# Altium project MINIMP3.PrjPcb
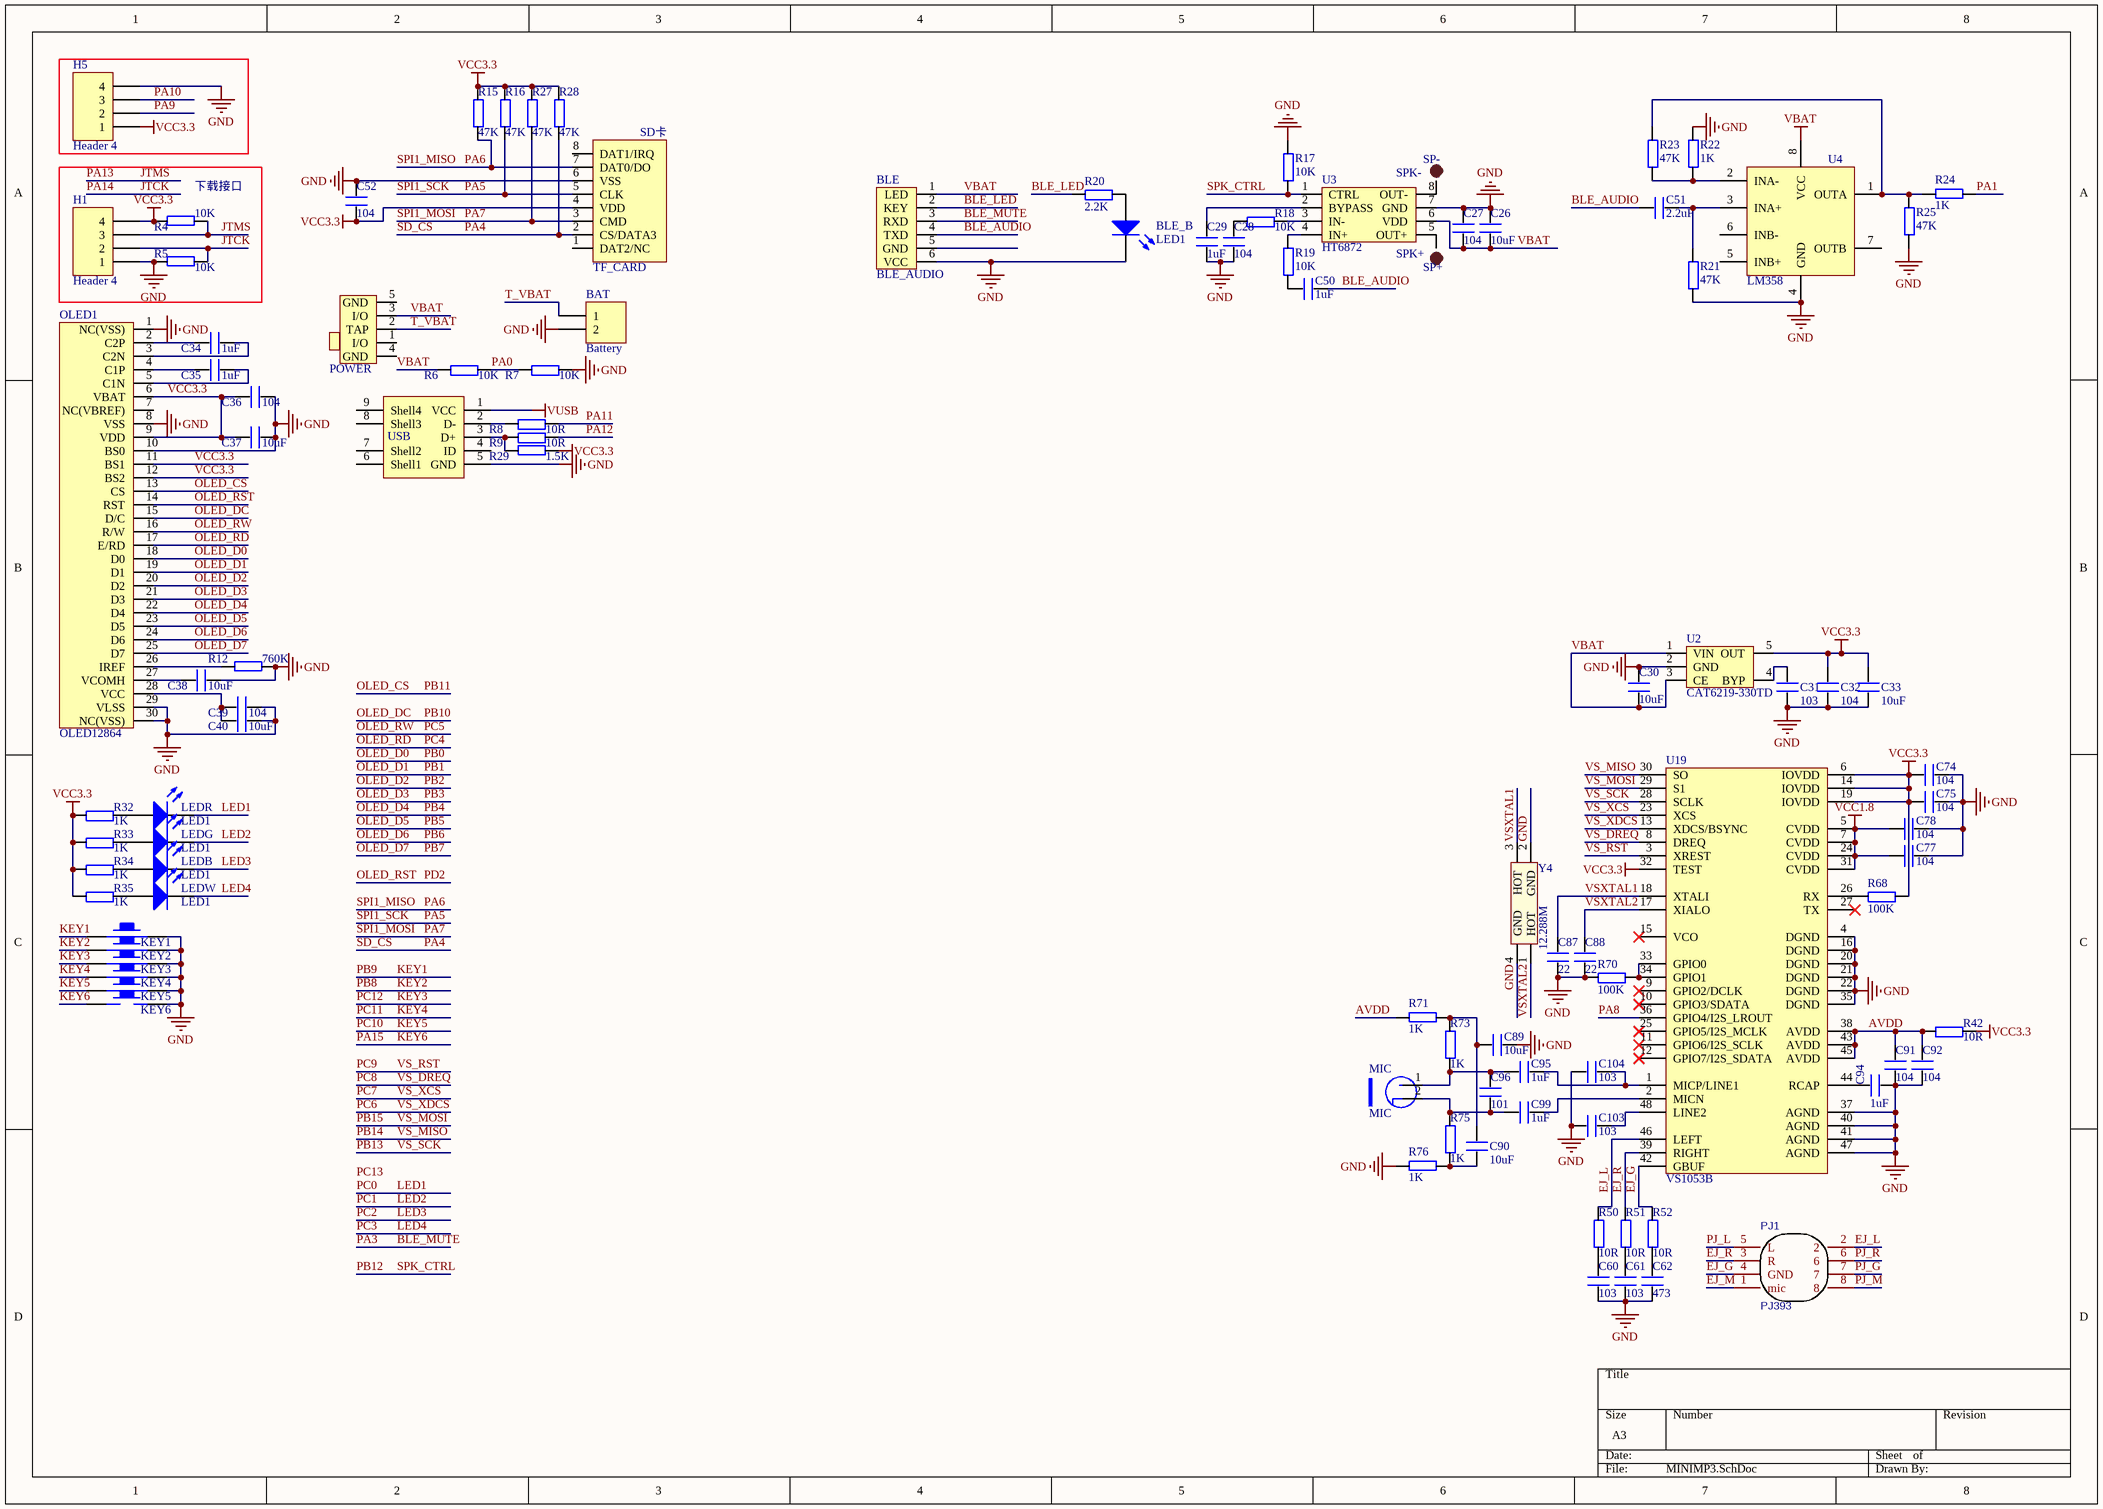
[diagram p0: MINIMP3.SchDoc]
2 sheets, 121 parts. Net scope: global (net labels, ports and power ports of the same name join across sheets).
Board file: MINIMP3.PcbDoc
Sheets:
  MINIMP3.SchDoc
  STM32F103RCT6_Core.SchDoc

## Sheet MINIMP3.SchDoc
size A3

### Parts
BAT  Battery  [HDR2.54-LI-2P]
BLE  BLE_AUDIO  [HEAD6]
BLE_B  LED1  [LED 0805B]
C26  10uF  [C 0603_M]
C27  104  [C 0603_M]
C28  104  [C 0603_M]
C29  1uF  [C 0603_M]
C30  10uF  [C 0603_M]
C31  103  [C 0603_M]
C32  104  [C 0603_M]
C33  10uF  [C 0603_M]
C34  1uF  [C 0603_M]
C35  1uF  [C 0603_M]
C36  104  [C 0603_M]
C37  10uF  [C 0603_M]
C38  10uF  [C 0603_M]
C39  104  [C 0603_M]
C40  10uF  [C 0603_M]
C50  1uF  [C 0603_M]
C51  2.2uF  [C 0603_M]
C52  104  [C 0603_M]
C60  103  [C 0603_M]
C61  103  [C 0603_M]
C62  473  [C 0603_M]
C74  104  [C 0603_M]
C75  104  [C 0603_M]
C77  104  [C 0603_M]
C78  104  [C 0603_M]
C87  22  [C 0603_M]
C88  22  [C 0603_M]
C89  10uF  [C 0805_M]
C90  10uF  [C 0805_M]
C91  104  [C 0603_M]
C92  104  [C 0603_M]
C94  1uF  [C 0603_M]
C95  1uF  [C 0603_M]
C96  101  [C 0603_M]
C99  1uF  [C 0603_M]
C103  103  [C 0603_M]
C104  103  [C 0603_M]
H1  Header 4  [HDR2.54-LI-4P]
H5  Header 4  [HDR2.54-LI-4P]
KEY1  KEY_M  [KEY-SOP324225]  (value not drawn)
KEY2  KEY_M  [KEY-SOP324225]  (value not drawn)
KEY3  KEY_M  [KEY-SOP324225]  (value not drawn)
KEY4  KEY_M  [KEY-SOP324225]  (value not drawn)
KEY5  KEY_M  [KEY-SOP324225]  (value not drawn)
KEY6  KEY_M  [KEY-SOP324225]  (value not drawn)
LEDB  LED1  [LED 0805B]
LEDG  LED1  [LED 0805B]
LEDR  LED1  [LED 0805B]
LEDW  LED1  [LED 0805B]
MIC  MIC  [MIC-6022]
OLED1  OLED12864  [OLED_0.96]
PJ1  PJ393  [PJ393]
POWER  BUTTON_DIP3  [MSK-12C01-07]  (value not drawn)
R4  10K  [R 0603_M]
R5  10K  [R 0603_M]
R6  10K  [R 0603_M]
R7  10K  [R 0603_M]
R8  10R  [R 0603_M]
R9  10R  [R 0603_M]
R12  760K  [R 0603_M]
R15  47K  [R 0603_M]
R16  47K  [R 0603_M]
R17  10K  [R 0603_M]
R18  10K  [R 0603_M]
R19  10K  [R 0603_M]
R20  2.2K  [R 0603_M]
R21  47K  [R 0603_M]
R22  1K  [R 0603_M]
R23  47K  [R 0603_M]
R24  1K  [R 0603_M]
R25  47K  [R 0603_M]
R27  47K  [R 0603_M]
R28  47K  [R 0603_M]
R29  1.5K  [R 0603_M]
R32  1K  [R 0603_M]
R33  1K  [R 0603_M]
R34  1K  [R 0603_M]
R35  1K  [R 0603_M]
R42  10R  [R 0603_M]
R50  10R  [R 0603_M]
R51  10R  [R 0603_M]
R52  10R  [R 0603_M]
R68  100K  [R 0603_M]
R70  100K  [R 0603_M]
R71  1K  [R 0603_M]
R73  1K  [R 0603_M]
R75  1K  [R 0603_M]
R76  1K  [R 0603_M]
SP+  SPK+  [TP-1.5]
SP-  SPK-  [TP-1.5]
TF_CARD  SD-MICRO-TF  [SD-MICRO-TF]  (value not drawn)
U2  CAT6219-330TD  [SOT23-5N]
U3  HT6872  [SOP8_N]
U4  LM358  [SOP8_N]
U19  VS1053B  [LQFP-48N]
USB  J-MICRO-USB-5S  [USB-AB-5S]  (value not drawn)
Y4  12.288M  [OSC 3225-4P]

### Blocks framed on the sheet
下载接口: H1 R4 R5

### Nets
GND: BAT.2 BLE.6(VCC) BLE_B.2(K) C26.2 C27.2 C28.1 C29.1 C30.2 C31.1 C32.1 C33.1 C36.1 C37.1 C38.1 C39.1 C40.1 C52.2 C60.1 C61.1 C62.1 C74.2 C75.1 C77.2 C78.2 C87.1 C88.1 C89.1 C91.1 C92.1 C94.2 C103.2 C104.1 H1.1 H5.4 KEY1.2 KEY2.2 KEY3.2 KEY4.2 KEY5.2 KEY6.2 OLED1.1(NC(VSS)) OLED1.8(VSS) OLED1.10(BS0) OLED1.29(VLSS) OLED1.30(NC(VSS)) R5.2 R7.2 R12.1 R17.2 R21.1 R22.2 R25.1 R70.1 R76.2 TF_CARD.6(VSS) U2.2(GND) U3.7(GND) U4.4(GND) U19.4(DGND) U19.16(DGND) U19.20(DGND) U19.21(DGND) U19.22(DGND) U19.35(DGND) U19.37(AGND) U19.40(AGND) U19.41(AGND) U19.47(AGND) USB.5(GND) Y4.2(GND) Y4.4(GND)
VBAT: BLE.1(LED) C26.1 C27.1 C30.1 POWER.3(I/O) R6.1 U2.1(VIN) U2.3(CE) U3.6(VDD) U4.8(VCC)
VCC1.8: C77.1 C78.1 U19.5(CVDD) U19.7(CVDD) U19.24(CVDD) U19.31(CVDD)
VCC3.3: C32.2 C33.2 C36.2 C37.2 C52.1 C74.1 C75.2 H1.4 H5.1 OLED1.6(VBAT) OLED1.9(VDD) OLED1.11(BS1) OLED1.12(BS2) R4.2 R15.2 R16.2 R27.2 R28.2 R29.1 R32.1 R33.1 R34.1 R35.1 R42.2 R68.2 TF_CARD.4(VDD) U2.5(OUT) U19.6(IOVDD) U19.14(IOVDD) U19.19(IOVDD) U19.32(TEST)
VUSB: USB.1(VCC)
AVDD: C91.2 C92.2 R42.1 R71.2 U19.38(AVDD) U19.43(AVDD) U19.45(AVDD)
BLE_AUDIO: BLE.4(TXD) C50.2 C51.1
BLE_LED: BLE.2(KEY) R20.1
BLE_MUTE: BLE.3(RXD)  [also labelled PA3]
EJ_G: PJ1.4(GND) R52.2 U19.42(GBUF)
EJ_L: PJ1.2 R50.2 U19.46(LEFT)
EJ_M: PJ1.1(mic)
EJ_R: PJ1.3(R) R51.2 U19.39(RIGHT)
JTCK: H1.2 R5.1  [also labelled PA14]
JTMS: H1.3 R4.1  [also labelled PA13]
KEY1: KEY1.1  [also labelled PB9]
KEY2: KEY2.1  [also labelled PB8]
KEY3: KEY3.1  [also labelled PC12]
KEY4: KEY4.1  [also labelled PC11]
KEY5: KEY5.1  [also labelled PC10]
KEY6: KEY6.1  [also labelled PA15]
LED1: LEDR.2(K)  [also labelled PC0]
LED2: LEDG.2(K)  [also labelled PC1]
LED3: LEDB.2(K)  [also labelled PC2]
LED4: LEDW.2(K)  [also labelled PC3]
OLED_CS: OLED1.13(CS)  [also labelled PB11]
OLED_D0: OLED1.18(D0)  [also labelled PB0]
OLED_D1: OLED1.19(D1)  [also labelled PB1]
OLED_D2: OLED1.20(D2)  [also labelled PB2]
OLED_D3: OLED1.21(D3)  [also labelled PB3]
OLED_D4: OLED1.22(D4)  [also labelled PB4]
OLED_D5: OLED1.23(D5)  [also labelled PB5]
OLED_D6: OLED1.24(D6)  [also labelled PB6]
OLED_D7: OLED1.25(D7)  [also labelled PB7]
OLED_DC: OLED1.15(D/C)  [also labelled PB10]
OLED_RD: OLED1.17(E/RD)  [also labelled PC4]
OLED_RST: OLED1.14(RST)  [also labelled PD2]
OLED_RW: OLED1.16(R/W)  [also labelled PC5]
PA0: R6.2 R7.1
PA1: R24.1
PA4: R28.1 TF_CARD.2(CS/DATA3)  [also labelled SD_CS]
PA5: R16.1 TF_CARD.5(CLK)  [also labelled SPI1_SCK]
PA6: R15.1 TF_CARD.7(DAT0/DO)  [also labelled SPI1_MISO]
PA7: R27.1 TF_CARD.3(CMD)  [also labelled SPI1_MOSI]
PA8: U19.36(GPIO4/I2S_LROUT)
PA9: H5.2
PA10: H5.3
PA11: R8.2
PA12: R9.2
PB12: R17.1 U3.1(CTRL)  [also labelled SPK_CTRL]
PB13: U19.28(SCLK)  [also labelled VS_SCK]
PB14: U19.30(SO)  [also labelled VS_MISO]
PB15: U19.29(S1)  [also labelled VS_MOSI]
PC6: U19.13(XDCS/BSYNC)  [also labelled VS_XDCS]
PC7: U19.23(XCS)  [also labelled VS_XCS]
PC8: U19.8(DREQ)  [also labelled VS_DREQ]
PC9: U19.3(XREST)  [also labelled VS_RST]
PJ_G: PJ1.7
PJ_L: PJ1.5(L)
PJ_M: PJ1.8
PJ_R: PJ1.6
T_VBAT: BAT.1 POWER.2(TAP)
VSXTAL1: C87.2 U19.18(XTALI) Y4.3(HOT)
VSXTAL2: C88.2 U19.17(XIALO) Y4.1(HOT)
NetBLE_B_1: BLE_B.1(A) R20.2
NetC28_2: C28.2 R18.1
NetC29_2: C29.2 U3.2(BYPASS)
NetC31_2: C31.2 U2.4(BYP)
NetC34_1: C34.1 OLED1.3(C2N)
NetC34_2: C34.2 OLED1.2(C2P)
NetC35_1: C35.1 OLED1.5(C1N)
NetC35_2: C35.2 OLED1.4(C1P)
NetC38_2: C38.2 OLED1.27(VCOMH)
NetC39_2: C39.2 C40.2 OLED1.28(VCC)
NetC50_1: C50.1 R19.1
NetC51_2: C51.2 R21.2 U4.3(INA+)
NetC60_2: C60.2 R50.1
NetC61_2: C61.2 R51.1
NetC62_2: C62.2 R52.1
NetC89_2: C89.2 C90.2 R71.1 R73.2
NetC90_1: C90.1 R75.1 R76.1
NetC94_1: C94.1 U19.44(RCAP)
NetC95_1: C95.1 C96.2 MIC.1(VCC) R73.1
NetC95_2: C95.2 C104.2 U19.1(MICP/LINE1)
NetC96_1: C96.1 C99.2 MIC.2(GND) R75.2
NetC99_1: C99.1 U19.2(MICN)
NetC103_1: C103.1 U19.48(LINE2)
NetLEDB_1: LEDB.1(A) R34.2
NetLEDG_1: LEDG.1(A) R33.2
NetLEDR_1: LEDR.1(A) R32.2
NetLEDW_1: LEDW.1(A) R35.2
NetOLED1_26: OLED1.26(IREF) R12.2
NetR8_1: R8.1 USB.2(D-)
NetR9_1: R9.1 R29.2 USB.3(D+)
NetR18_2: R18.2 U3.3(IN-)
NetR19_2: R19.2 U3.4(IN+)
NetR22_1: R22.1 R23.1 U4.2(INA-)
NetR23_2: R23.2 R24.2 R25.2 U4.1(OUTA)
NetR68_1: R68.1 U19.26(RX)
NetR70_2: R70.2 U19.33(GPIO0) U19.34(GPIO1)
NetSP+_1: SP+.1 U3.5(OUT+)
NetSP-_1: SP-.1 U3.8(OUT-)

Not connected (* = marked no-connect by the designer): BLE 5(GND); OLED1 7(NC(VBREF)); POWER 1(I/O) 4(GND) 5(GND); TF_CARD 1(DAT2/NC) 8(DAT1/IRQ); U4 5(INB+) 6(INB-) 7(OUTB); U19 9(GPIO2/DCLK)* 10(GPIO3/SDATA)* 11(GPIO6/I2S_SCLK)* 12(GPIO7/I2S_SDATA)* 15(VCO)* 25(GPIO5/I2S_MCLK)* 27(TX)*; USB 4(ID) 6(Shell1) 7(Shell2) 8(Shell3) 9(Shell4)

### Notes on the sheet
- (near TF_CARD) SD卡
- Labels drawn without touching a wire or pin: PC13

### Library data of the parts
BAT = Header 2: Header, 2-Pin; LatestRevisionDate: 17-Jul-2002; LatestRevisionNote: Re-released for DXP Platform.; Publisher: Altium Limited
BLE = ATK-HC05
BLE_B LEDB LEDG LEDR LEDW = LED2: Typical RED, GREEN, YELLOW, AMBER GaAs LED; Published: 8-Jun-2000; LatestRevisionDate: 17-Jul-2002; LatestRevisionNote: Re-released for DXP Platform.; PackageDocument: Feb-2002; PackageReference: 3.2X1.6X1.1; Publisher: Altium Limited
C26-C40 C50-C52 C60-C62 C74 C75 C77 C78 C87-C92 C94-C96 C99 C103 C104 = C
H1 H5 = Header 4: Header, 4-Pin; LatestRevisionDate: 17-Jul-2002; LatestRevisionNote: Re-released for DXP Platform.; Publisher: Altium Limited
PJ1 = PJ393: Contributor: infinite_possibilities; BOM_Manufacturer Part: ?; spicePre: U
POWER = BUTTON_DIP3: 拨动开关SS-12F44
R4-R9 R12 R15-R25 R27-R29 R32-R35 R42 R50-R52 R68 R70 R71 R73 R75 R76 = R
SP+ SP- = TEST-POINT: 测试点
TF_CARD = SD-MICRO-TF: SD,MICRO,TF
U2 = CAT6219-330TD: 3.3V 500mA LDO
U3 = HT6871
U4 = Component_2
U19 = VS1053
USB = J-MICRO-USB-5S: Micro USB 5.9有柱脚长1.25加长针
Y4 = XTAL_3225: 3225贴片无源晶振

## Sheet STM32F103RCT6_Core.SchDoc
size A4
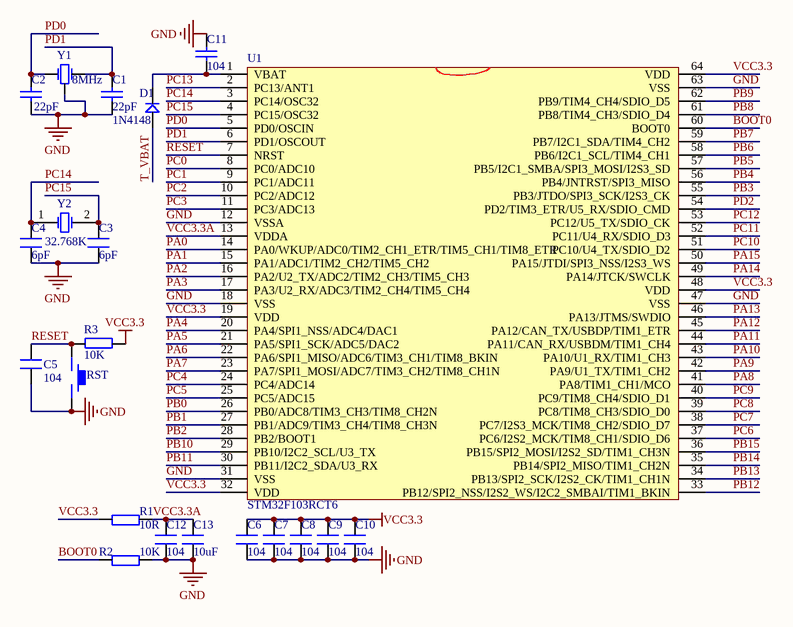
[diagram p1: STM32F103RCT6_Core.SchDoc]

### Parts
C1  22pF  [C 0603_M]
C2  22pF  [C 0603_M]
C3  6pF  [C 0603_M]
C4  6pF  [C 0603_M]
C5  104  [C 0603_M]
C6  104  [C 0603_M]
C7  104  [C 0603_M]
C8  104  [C 0603_M]
C9  104  [C 0603_M]
C10  104  [C 0603_M]
C11  104  [C 0603_M]
C12  104  [C 0603_M]
C13  10uF  [C 0603_M]
D1  1N4148  [MINI_MELF (LL34)]
R1  10R  [R 0603_M]
R2  10K  [R 0603_M]
R3  10K  [R 0603_M]
RST  S-KEY-SMD-324225  [TSW SMD-3*6*2.5]  (value not drawn)
U1  STM32F103RCT6  [LQFP-64N]
Y1  8MHz  [Y-XTAL-3215-3P]
Y2  32.768K  [OSC 3215-2P]

### Nets
GND: C1.1 C2.1 C3.1 C4.1 C5.1 C6.1 C7.1 C8.1 C9.1 C10.1 C11.1 C12.1 C13.1 R2.2 RST.2 U1.12(VSSA) U1.18(VSS) U1.31(VSS) U1.47(VSS) U1.63(VSS) Y1.2(GND)
VCC3.3: C6.2 C7.2 C8.2 C9.2 C10.2 R1.1 R3.1 U1.19(VDD) U1.32(VDD) U1.48(VDD) U1.64(VDD)
BOOT0: R2.1 U1.60(BOOT0)
PA0: U1.14(PA0/WKUP/ADC0/TIM2_CH1_ETR/TIM5_CH1/TIM8_ETR)
PA1: U1.15(PA1/ADC1/TIM2_CH2/TIM5_CH2)
PA2: U1.16(PA2/U2_TX/ADC2/TIM2_CH3/TIM5_CH3)
PA3: U1.17(PA3/U2_RX/ADC3/TIM2_CH4/TIM5_CH4)  [project net BLE_MUTE]
PA4: U1.20(PA4/SPI1_NSS/ADC4/DAC1)
PA5: U1.21(PA5/SPI1_SCK/ADC5/DAC2)
PA6: U1.22(PA6/SPI1_MISO/ADC6/TIM3_CH1/TIM8_BKIN)
PA7: U1.23(PA7/SPI1_MOSI/ADC7/TIM3_CH2/TIM8_CH1N)
PA8: U1.41(PA8/TIM1_CH1/MCO)
PA9: U1.42(PA9/U1_TX/TIM1_CH2)
PA10: U1.43(PA10/U1_RX/TIM1_CH3)
PA11: U1.44(PA11/CAN_RX/USBDM/TIM1_CH4)
PA12: U1.45(PA12/CAN_TX/USBDP/TIM1_ETR)
PA13: U1.46(PA13/JTMS/SWDIO)  [project net JTMS]
PA14: U1.49(PA14/JTCK/SWCLK)  [project net JTCK]
PA15: U1.50(PA15/JTDI/SPI3_NSS/I2S3_WS)  [project net KEY6]
PB0: U1.26(PB0/ADC8/TIM3_CH3/TIM8_CH2N)  [project net OLED_D0]
PB1: U1.27(PB1/ADC9/TIM3_CH4/TIM8_CH3N)  [project net OLED_D1]
PB2: U1.28(PB2/BOOT1)  [project net OLED_D2]
PB3: U1.55(PB3/JTDO/SPI3_SCK/I2S3_CK)  [project net OLED_D3]
PB4: U1.56(PB4/JNTRST/SPI3_MISO)  [project net OLED_D4]
PB5: U1.57(PB5/I2C1_SMBA/SPI3_MOSI/I2S3_SD)  [project net OLED_D5]
PB6: U1.58(PB6/I2C1_SCL/TIM4_CH1)  [project net OLED_D6]
PB7: U1.59(PB7/I2C1_SDA/TIM4_CH2)  [project net OLED_D7]
PB8: U1.61(PB8/TIM4_CH3/SDIO_D4)  [project net KEY2]
PB9: U1.62(PB9/TIM4_CH4/SDIO_D5)  [project net KEY1]
PB10: U1.29(PB10/I2C2_SCL/U3_TX)  [project net OLED_DC]
PB11: U1.30(PB11/I2C2_SDA/U3_RX)  [project net OLED_CS]
PB12: U1.33(PB12/SPI2_NSS/I2S2_WS/I2C2_SMBAI/TIM1_BKIN)
PB13: U1.34(PB13/SPI2_SCK/I2S2_CK/TIM1_CH1N)
PB14: U1.35(PB14/SPI2_MISO/TIM1_CH2N)
PB15: U1.36(PB15/SPI2_MOSI/I2S2_SD/TIM1_CH3N)
PC0: U1.8(PC0/ADC10)  [project net LED1]
PC1: U1.9(PC1/ADC11)  [project net LED2]
PC2: U1.10(PC2/ADC12)  [project net LED3]
PC3: U1.11(PC3/ADC13)  [project net LED4]
PC4: U1.24(PC4/ADC14)  [project net OLED_RD]
PC5: U1.25(PC5/ADC15)  [project net OLED_RW]
PC6: U1.37(PC6/I2S2_MCK/TIM8_CH1/SDIO_D6)
PC7: U1.38(PC7/I2S3_MCK/TIM8_CH2/SDIO_D7)
PC8: U1.39(PC8/TIM8_CH3/SDIO_D0)
PC9: U1.40(PC9/TIM8_CH4/SDIO_D1)
PC10: U1.51(PC10/U4_TX/SDIO_D2)  [project net KEY5]
PC11: U1.52(PC11/U4_RX/SDIO_D3)  [project net KEY4]
PC12: U1.53(PC12/U5_TX/SDIO_CK)  [project net KEY3]
PC13: U1.2(PC13/ANT1)
PC14: C4.2 U1.3(PC14/OSC32) Y2.1(OSC1)
PC15: C3.2 U1.4(PC15/OSC32) Y2.2(OSC2)
PD0: C2.2 U1.5(PD0/OSCIN) Y1.1(OSC1)
PD1: C1.2 U1.6(PD1/OSCOUT) Y1.3(OSC2)
PD2: U1.54(PD2/TIM3_ETR/U5_RX/SDIO_CMD)  [project net OLED_RST]
RESET: C5.2 R3.2 RST.1 U1.7(NRST)
T_VBAT: D1.1
VCC3.3A: C12.2 C13.2 R1.2 U1.13(VDDA)
NetC11_2: C11.2 D1.2 U1.1(VBAT)

### Library data of the parts
C1 C2 C11 = CAP
C3-C10 C12 C13 = C
D1 = D
R1-R3 = R
RST = S-KEY-SMD-324225: KEY,SMD,324225
U1 = STM32F103RDT6
Y1 = Y-3215-8M: XTAL,3215,8MHz
Y2 = XTAL: Crystal Oscillator; Published: 8-Jun-2000; LatestRevisionDate: 17-Jul-2002; LatestRevisionNote: Re-released for DXP Platform.; Publisher: Altium Limited

## Nets that join several sheets
GND: MINIMP3 (71 pins), STM32F103RCT6_Core (21 pins)
VCC3.3: MINIMP3 (31 pins), STM32F103RCT6_Core (11 pins)
BLE_MUTE: MINIMP3 (BLE.3), STM32F103RCT6_Core (U1.17)
JTCK: MINIMP3 (H1.2 R5.1), STM32F103RCT6_Core (U1.49)
JTMS: MINIMP3 (H1.3 R4.1), STM32F103RCT6_Core (U1.46)
KEY1: MINIMP3 (KEY1.1), STM32F103RCT6_Core (U1.62)
KEY2: MINIMP3 (KEY2.1), STM32F103RCT6_Core (U1.61)
KEY3: MINIMP3 (KEY3.1), STM32F103RCT6_Core (U1.53)
KEY4: MINIMP3 (KEY4.1), STM32F103RCT6_Core (U1.52)
KEY5: MINIMP3 (KEY5.1), STM32F103RCT6_Core (U1.51)
KEY6: MINIMP3 (KEY6.1), STM32F103RCT6_Core (U1.50)
LED1: MINIMP3 (LEDR.2), STM32F103RCT6_Core (U1.8)
LED2: MINIMP3 (LEDG.2), STM32F103RCT6_Core (U1.9)
LED3: MINIMP3 (LEDB.2), STM32F103RCT6_Core (U1.10)
LED4: MINIMP3 (LEDW.2), STM32F103RCT6_Core (U1.11)
OLED_CS: MINIMP3 (OLED1.13), STM32F103RCT6_Core (U1.30)
OLED_D0: MINIMP3 (OLED1.18), STM32F103RCT6_Core (U1.26)
OLED_D1: MINIMP3 (OLED1.19), STM32F103RCT6_Core (U1.27)
OLED_D2: MINIMP3 (OLED1.20), STM32F103RCT6_Core (U1.28)
OLED_D3: MINIMP3 (OLED1.21), STM32F103RCT6_Core (U1.55)
OLED_D4: MINIMP3 (OLED1.22), STM32F103RCT6_Core (U1.56)
OLED_D5: MINIMP3 (OLED1.23), STM32F103RCT6_Core (U1.57)
OLED_D6: MINIMP3 (OLED1.24), STM32F103RCT6_Core (U1.58)
OLED_D7: MINIMP3 (OLED1.25), STM32F103RCT6_Core (U1.59)
OLED_DC: MINIMP3 (OLED1.15), STM32F103RCT6_Core (U1.29)
OLED_RD: MINIMP3 (OLED1.17), STM32F103RCT6_Core (U1.24)
OLED_RST: MINIMP3 (OLED1.14), STM32F103RCT6_Core (U1.54)
OLED_RW: MINIMP3 (OLED1.16), STM32F103RCT6_Core (U1.25)
PA0: MINIMP3 (R6.2 R7.1), STM32F103RCT6_Core (U1.14)
PA1: MINIMP3 (R24.1), STM32F103RCT6_Core (U1.15)
PA4: MINIMP3 (R28.1 TF_CARD.2), STM32F103RCT6_Core (U1.20)
PA5: MINIMP3 (R16.1 TF_CARD.5), STM32F103RCT6_Core (U1.21)
PA6: MINIMP3 (R15.1 TF_CARD.7), STM32F103RCT6_Core (U1.22)
PA7: MINIMP3 (R27.1 TF_CARD.3), STM32F103RCT6_Core (U1.23)
PA8: MINIMP3 (U19.36), STM32F103RCT6_Core (U1.41)
PA9: MINIMP3 (H5.2), STM32F103RCT6_Core (U1.42)
PA10: MINIMP3 (H5.3), STM32F103RCT6_Core (U1.43)
PA11: MINIMP3 (R8.2), STM32F103RCT6_Core (U1.44)
PA12: MINIMP3 (R9.2), STM32F103RCT6_Core (U1.45)
PB12: MINIMP3 (R17.1 U3.1), STM32F103RCT6_Core (U1.33)
PB13: MINIMP3 (U19.28), STM32F103RCT6_Core (U1.34)
PB14: MINIMP3 (U19.30), STM32F103RCT6_Core (U1.35)
PB15: MINIMP3 (U19.29), STM32F103RCT6_Core (U1.36)
PC6: MINIMP3 (U19.13), STM32F103RCT6_Core (U1.37)
PC7: MINIMP3 (U19.23), STM32F103RCT6_Core (U1.38)
PC8: MINIMP3 (U19.8), STM32F103RCT6_Core (U1.39)
PC9: MINIMP3 (U19.3), STM32F103RCT6_Core (U1.40)
T_VBAT: MINIMP3 (BAT.1 POWER.2), STM32F103RCT6_Core (D1.1)